# EAGLE schematic borrador_v1 (EAGLE 9.5.2)
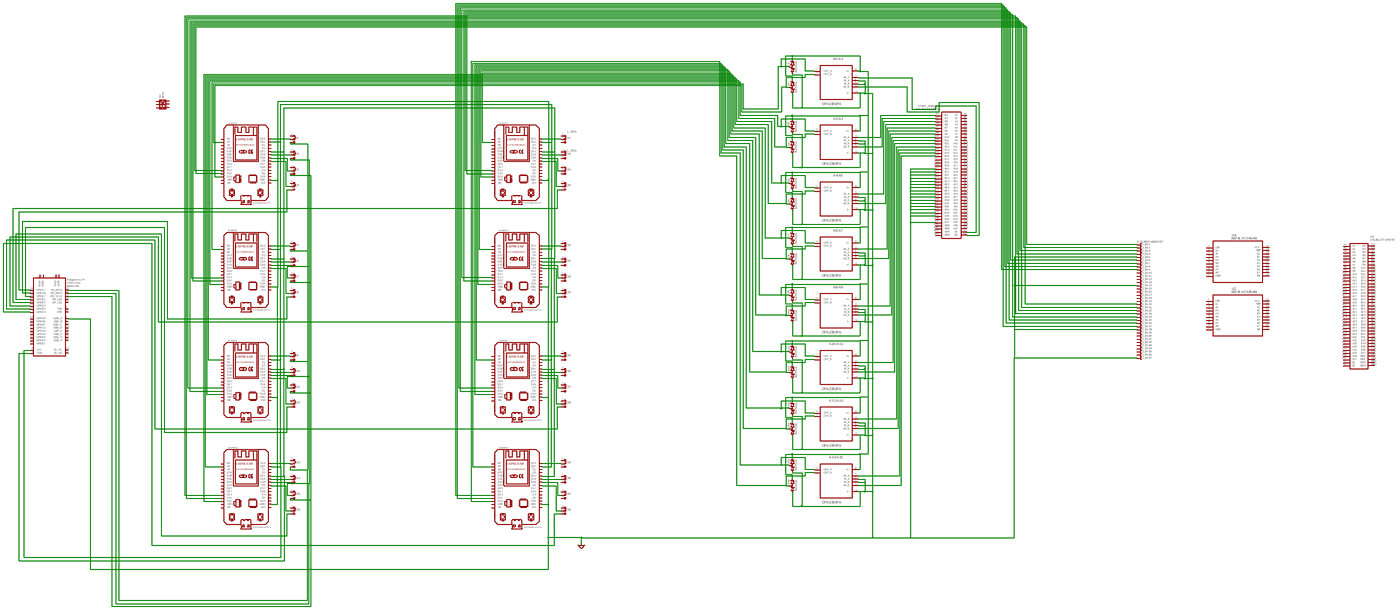
[diagram p0: schematic, sheet 1, overview]
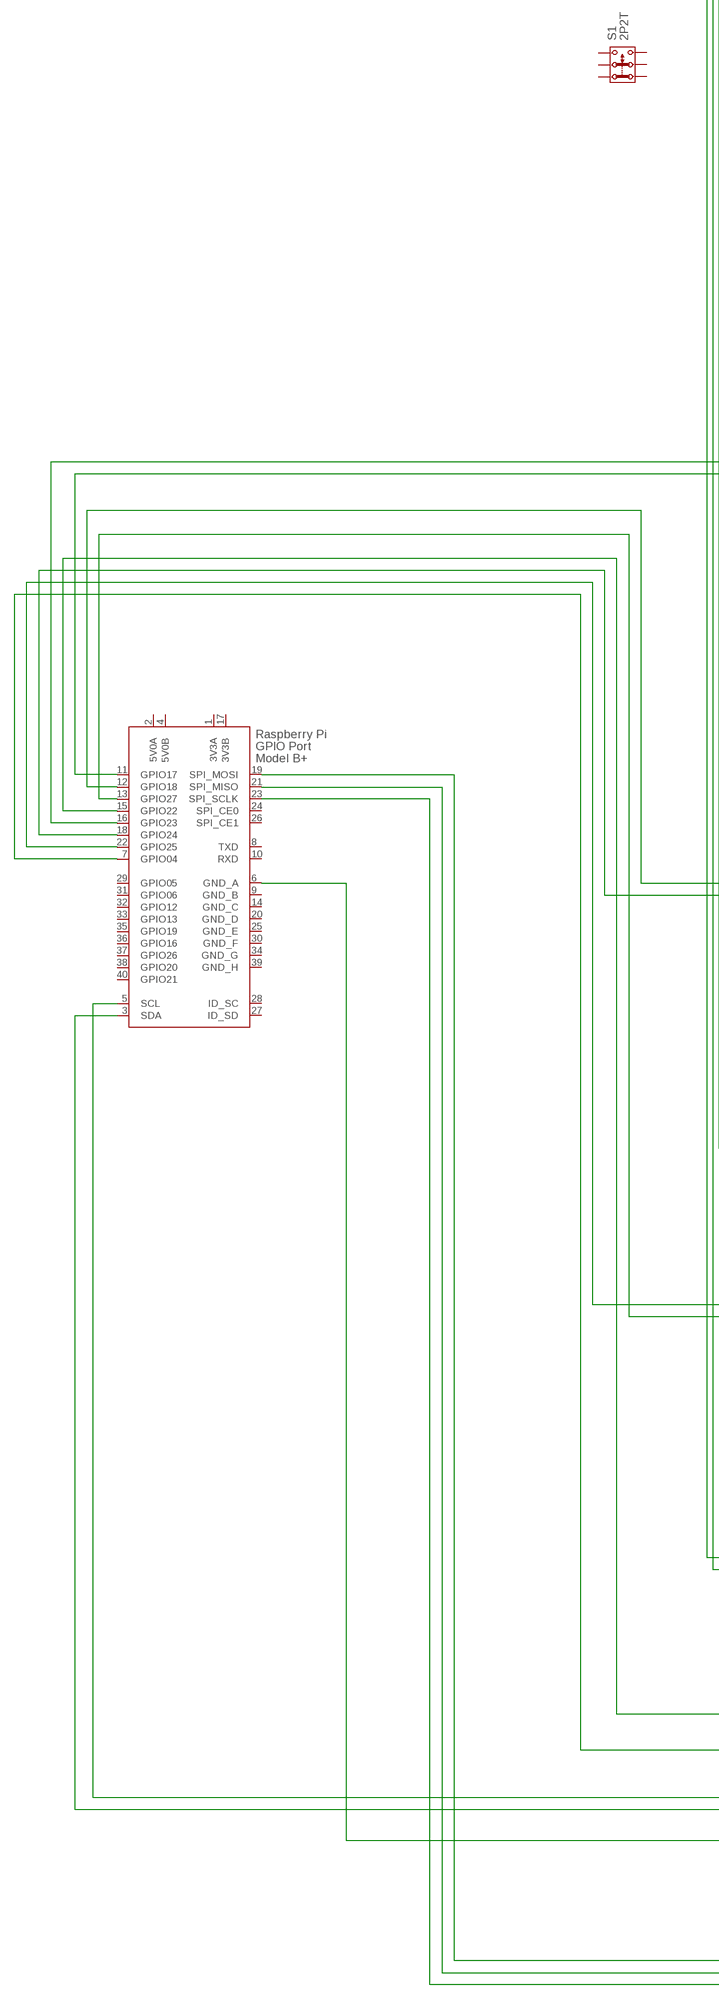
[diagram p1: schematic, sheet 1, part 1 of 4]
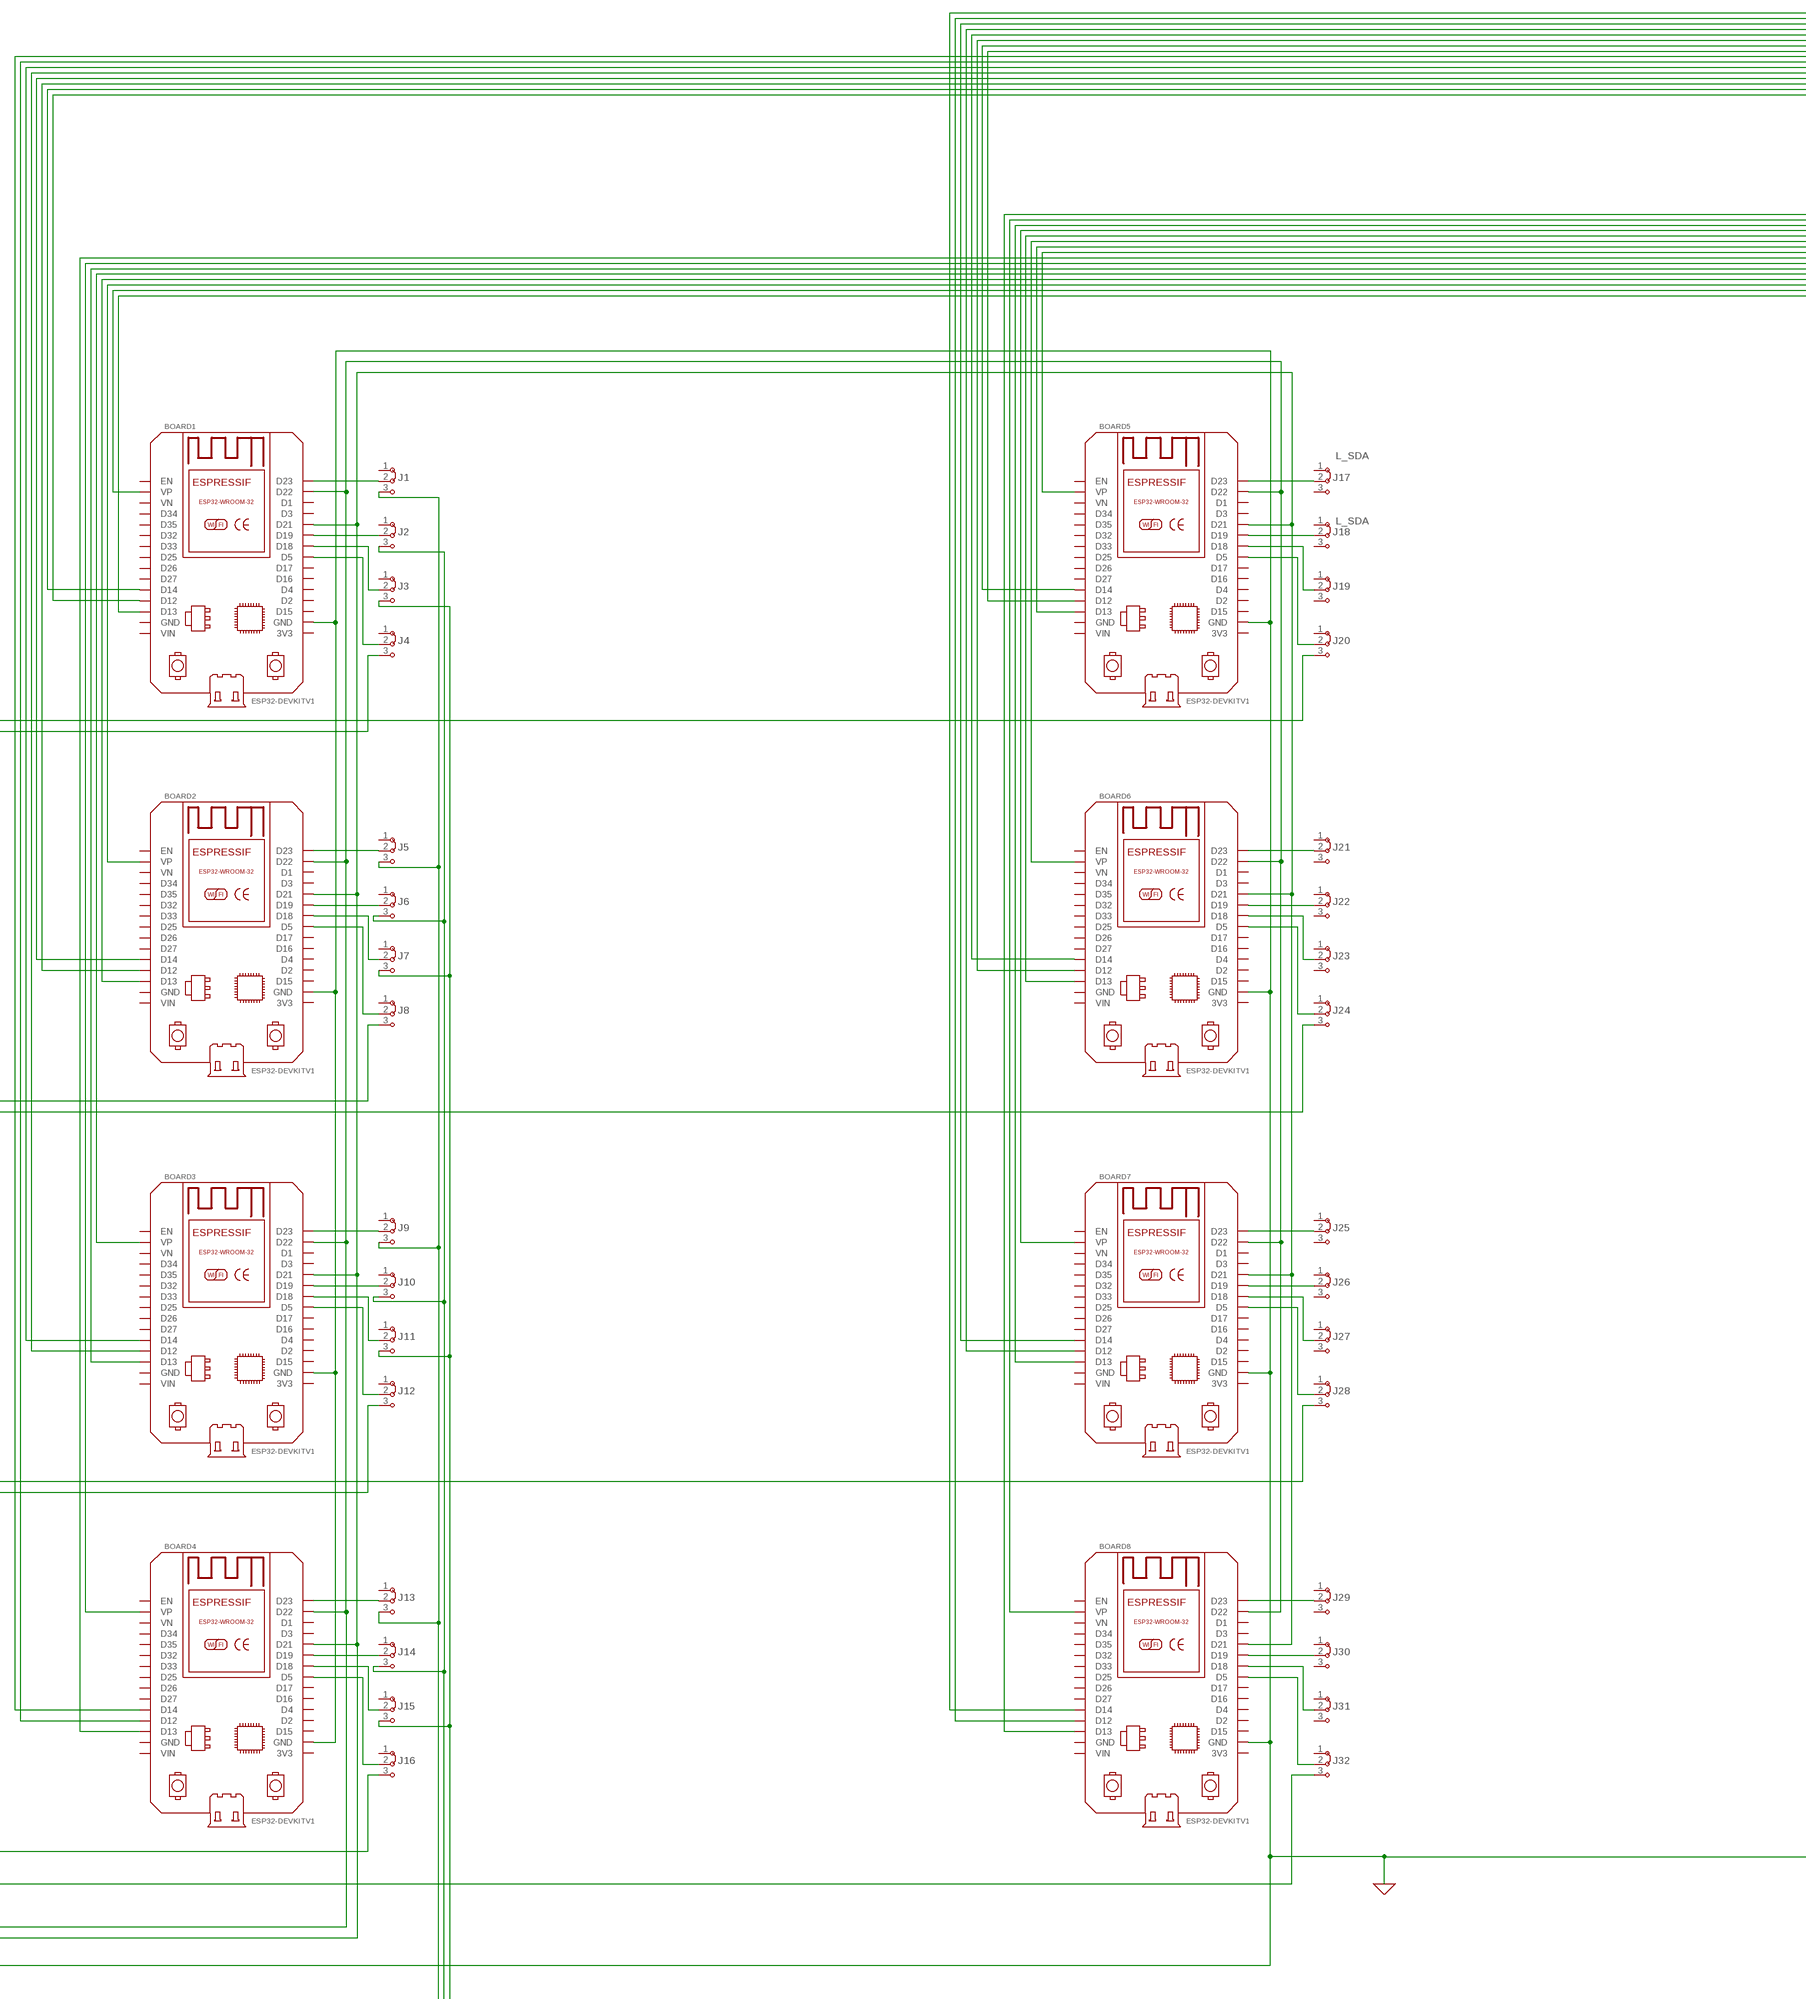
[diagram p2: schematic, sheet 1, part 2 of 4]
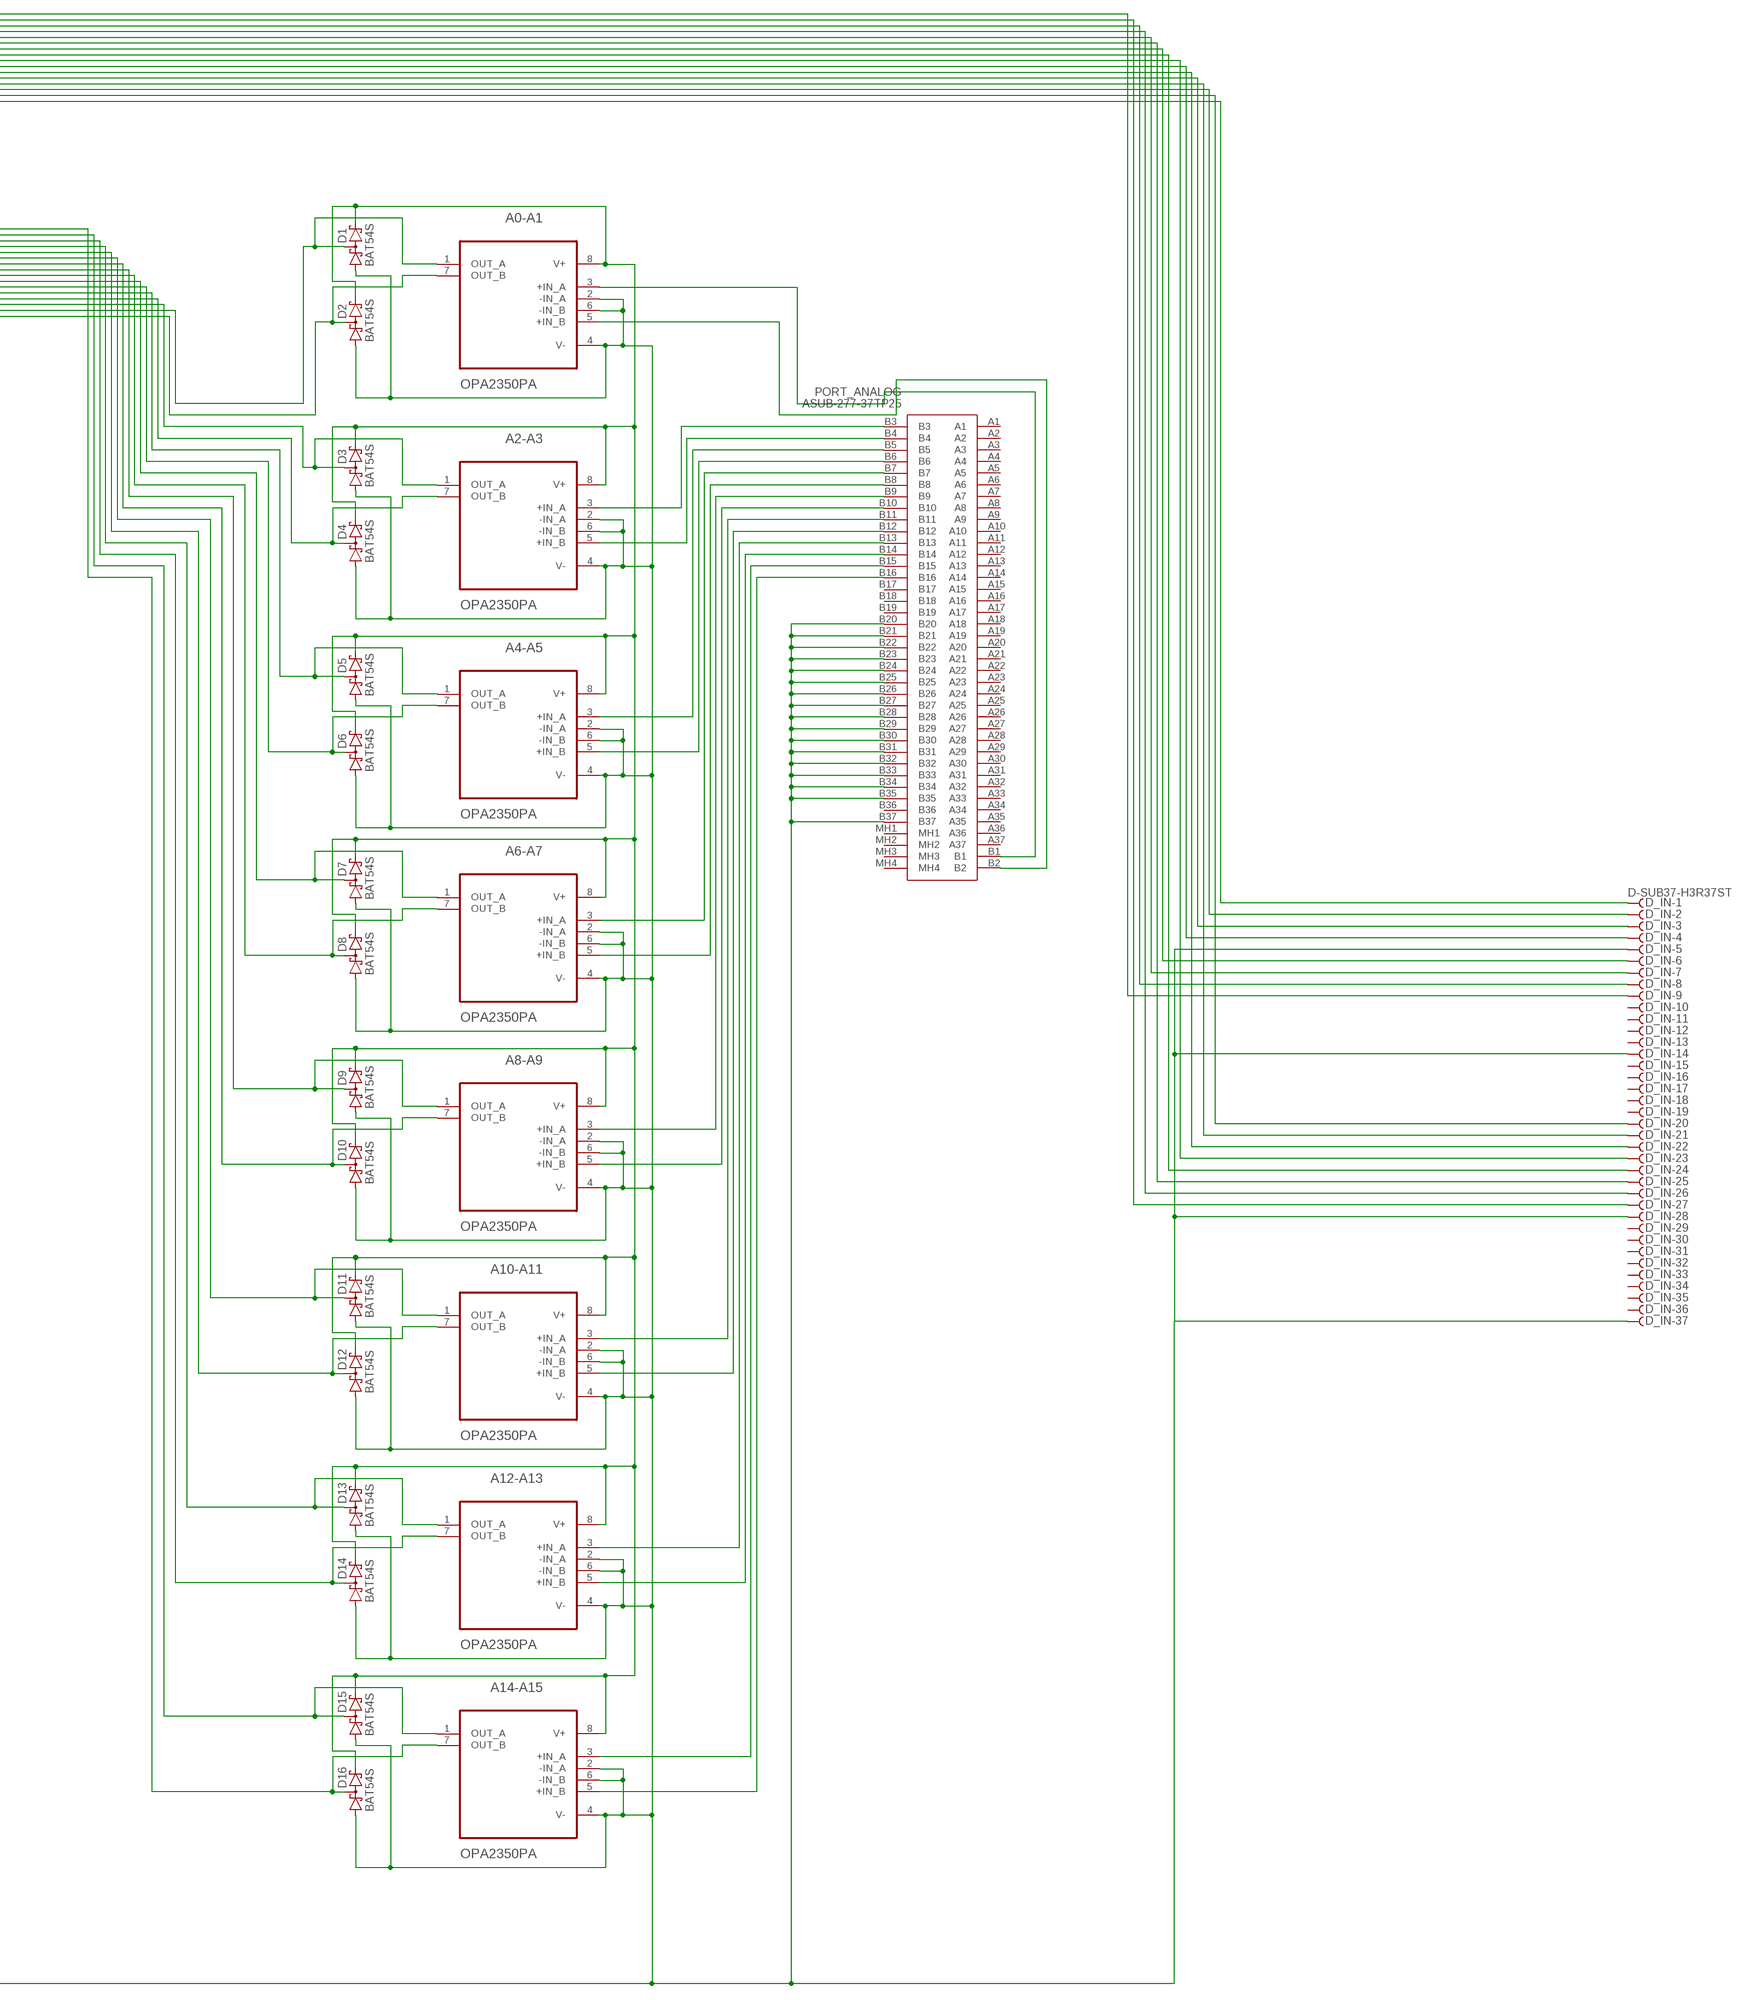
[diagram p3: schematic, sheet 1, part 3 of 4]
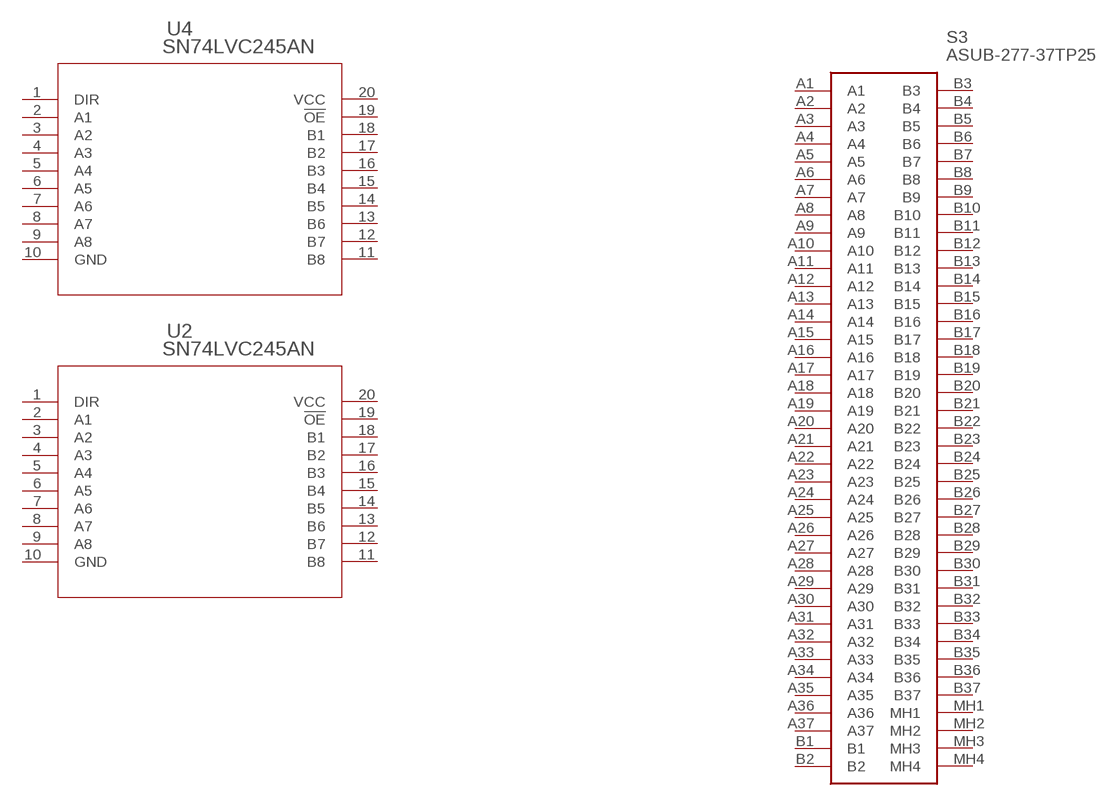
[diagram p4: schematic, sheet 1, part 4 of 4]

## Parts
A0-A1  OPA2350PA  [DIP254P762X508-8]
A2-A3  OPA2350PA  [DIP254P762X508-8]
A4-A5  OPA2350PA  [DIP254P762X508-8]
A6-A7  OPA2350PA  [DIP254P762X508-8]
A8-A9  OPA2350PA  [DIP254P762X508-8]
A10-A11  OPA2350PA  [DIP254P762X508-8]
A12-A13  OPA2350PA  [DIP254P762X508-8]
A14-A15  OPA2350PA  [DIP254P762X508-8]
BOARD1  ESP32DEVKITV1  [ESP32-DEVKITV1]
BOARD2  ESP32DEVKITV1  [ESP32-DEVKITV1]
BOARD3  ESP32DEVKITV1  [ESP32-DEVKITV1]
BOARD4  ESP32DEVKITV1  [ESP32-DEVKITV1]
BOARD5  ESP32DEVKITV1  [ESP32-DEVKITV1]
BOARD6  ESP32DEVKITV1  [ESP32-DEVKITV1]
BOARD7  ESP32DEVKITV1  [ESP32-DEVKITV1]
BOARD8  ESP32DEVKITV1  [ESP32-DEVKITV1]
D1  BAT54S  [SOT23]
D2  BAT54S  [SOT23]
D3  BAT54S  [SOT23]
D4  BAT54S  [SOT23]
D5  BAT54S  [SOT23]
D6  BAT54S  [SOT23]
D7  BAT54S  [SOT23]
D8  BAT54S  [SOT23]
D9  BAT54S  [SOT23]
D10  BAT54S  [SOT23]
D11  BAT54S  [SOT23]
D12  BAT54S  [SOT23]
D13  BAT54S  [SOT23]
D14  BAT54S  [SOT23]
D15  BAT54S  [SOT23]
D16  BAT54S  [SOT23]
D_IN  D-SUB37-H3R37ST  [H2R37ST]
J1  J2X2MM  [04C]
J2  J2X2MM  [04C]
J3  J2X2MM  [04C]
J4  J2X2MM  [04C]
J5  J2X2MM  [04C]
J6  J2X2MM  [04C]
J7  J2X2MM  [04C]
J8  J2X2MM  [04C]
J9  J2X2MM  [04C]
J10  J2X2MM  [04C]
J11  J2X2MM  [04C]
J12  J2X2MM  [04C]
J13  J2X2MM  [04C]
J14  J2X2MM  [04C]
J15  J2X2MM  [04C]
J16  J2X2MM  [04C]
J17  J2X2MM  [04C]
J18  J2X2MM  [04C]
J19  J2X2MM  [04C]
J20  J2X2MM  [04C]
J21  J2X2MM  [04C]
J22  J2X2MM  [04C]
J23  J2X2MM  [04C]
J24  J2X2MM  [04C]
J25  J2X2MM  [04C]
J26  J2X2MM  [04C]
J27  J2X2MM  [04C]
J28  J2X2MM  [04C]
J29  J2X2MM  [04C]
J30  J2X2MM  [04C]
J31  J2X2MM  [04C]
J32  J2X2MM  [04C]
PORT_ANALOG  ASUB-277-37TP25  [ASUB27737TP25]
S1  2P2T  [2P2T]
S3  ASUB-277-37TP25  [ASUB27737TP25]
U2  SN74LVC245AN  [N20]
U4  SN74LVC245AN  [N20]
X1  RASPI_GPIO_B+#_PIN  [RASPI_GPIO_B+_PIN]

## Nets
L_3V3: A0-A1.8(V+) A2-A3.8(V+) A4-A5.8(V+) A6-A7.8(V+) A8-A9.8(V+) A10-A11.8(V+) A12-A13.8(V+) A14-A15.8(V+) D1.2(C2) D2.2(C2) D3.2(C2) D4.2(C2) D5.2(C2) D6.2(C2) D7.2(C2) D8.2(C2) D9.2(C2) D10.2(C2) D11.2(C2) D12.2(C2) D13.2(C2) D14.2(C2) D15.2(C2) D16.2(C2)
L_AO_0: A0-A1.1(OUT_A) BOARD1.VP D1.3(C1A2)
L_AO_0_P: A0-A1.3(+IN_A) PORT_ANALOG.B1
L_AO_1: A0-A1.7(OUT_B) BOARD1.D13 D2.3(C1A2)
L_AO_1_P: A0-A1.5(+IN_B) PORT_ANALOG.B2
L_AO_2: A2-A3.1(OUT_A) BOARD2.VP D3.3(C1A2)
L_AO_2_P: A2-A3.3(+IN_A) PORT_ANALOG.B3
L_AO_3: A2-A3.7(OUT_B) BOARD2.D13 D4.3(C1A2)
L_AO_3_P: A2-A3.5(+IN_B) PORT_ANALOG.B4
L_AO_4: A4-A5.1(OUT_A) BOARD3.VP D5.3(C1A2)
L_AO_4_P: A4-A5.3(+IN_A) PORT_ANALOG.B5
L_AO_5: A4-A5.7(OUT_B) BOARD3.D13 D6.3(C1A2)
L_AO_5_P: A4-A5.5(+IN_B) PORT_ANALOG.B6
L_AO_6: A6-A7.1(OUT_A) BOARD4.VP D7.3(C1A2)
L_AO_6_P: A6-A7.3(+IN_A) PORT_ANALOG.B7
L_AO_7: A6-A7.7(OUT_B) BOARD4.D13 D8.3(C1A2)
L_AO_7_P: A6-A7.5(+IN_B) PORT_ANALOG.B8
L_AO_8: A8-A9.1(OUT_A) BOARD5.VP D9.3(C1A2)
L_AO_8_P: A8-A9.3(+IN_A) PORT_ANALOG.B9
L_AO_9: A8-A9.7(OUT_B) BOARD5.D13 D10.3(C1A2)
L_AO_9_P: A8-A9.5(+IN_B) PORT_ANALOG.B10
L_AO_10: A10-A11.1(OUT_A) BOARD6.VP D11.3(C1A2)
L_AO_10_P: A10-A11.3(+IN_A) PORT_ANALOG.B11
L_AO_11: A10-A11.7(OUT_B) BOARD6.D13 D12.3(C1A2)
L_AO_11_P: A10-A11.5(+IN_B) PORT_ANALOG.B12
L_AO_12: A12-A13.1(OUT_A) BOARD7.VP D13.3(C1A2)
L_AO_12_P: A12-A13.3(+IN_A) PORT_ANALOG.B13
L_AO_13: A12-A13.7(OUT_B) BOARD7.D13 D14.3(C1A2)
L_AO_13_P: A12-A13.5(+IN_B) PORT_ANALOG.B14
L_AO_14: A14-A15.1(OUT_A) BOARD8.VP D15.3(C1A2)
L_AO_14_P: A14-A15.3(+IN_A) PORT_ANALOG.B15
L_AO_15: A14-A15.7(OUT_B) BOARD8.D13 D16.3(C1A2)
L_AO_15_P: A14-A15.5(+IN_B) PORT_ANALOG.B16
L_DI_0: BOARD1.D12 D_IN.1
L_DI_1: BOARD1.D14 D_IN.20
L_DI_2: BOARD2.D12 D_IN.2
L_DI_3: BOARD2.D14 D_IN.21
L_DI_4: BOARD3.D12 D_IN.3
L_DI_5: BOARD3.D14 D_IN.22
L_DI_6: BOARD4.D12 D_IN.4
L_DI_7: BOARD4.D14 D_IN.23
L_DI_8: BOARD5.D12 D_IN.24
L_DI_9: BOARD5.D14 D_IN.6
L_DI_10: BOARD6.D12 D_IN.25
L_DI_11: BOARD6.D14 D_IN.7
L_DI_012: BOARD7.D12 D_IN.26
L_DI_13: BOARD7.D14 D_IN.8
L_DI_014: BOARD8.D12 D_IN.27
L_DI_015: BOARD8.D14 D_IN.9
L_GROUND: A0-A1.2(-IN_A) A0-A1.4(V-) A0-A1.6(-IN_B) A2-A3.2(-IN_A) A2-A3.4(V-) A2-A3.6(-IN_B) A4-A5.2(-IN_A) A4-A5.4(V-) A4-A5.6(-IN_B) A6-A7.2(-IN_A) A6-A7.4(V-) A6-A7.6(-IN_B) A8-A9.2(-IN_A) A8-A9.4(V-) A8-A9.6(-IN_B) A10-A11.2(-IN_A) A10-A11.4(V-) A10-A11.6(-IN_B) A12-A13.2(-IN_A) A12-A13.4(V-) A12-A13.6(-IN_B) A14-A15.2(-IN_A) A14-A15.4(V-) A14-A15.6(-IN_B) BOARD1.GND@1(GND) BOARD2.GND@1(GND) BOARD3.GND@1(GND) BOARD4.GND@1(GND) BOARD5.GND@1(GND) BOARD6.GND@1(GND) BOARD7.GND@1(GND) BOARD8.GND@1(GND) D1.1(A1) D2.1(A1) D3.1(A1) D4.1(A1) D5.1(A1) D6.1(A1) D7.1(A1) D8.1(A1) D9.1(A1) D10.1(A1) D11.1(A1) D12.1(A1) D13.1(A1) D14.1(A1) D15.1(A1) D16.1(A1) D_IN.5 D_IN.14 D_IN.28 D_IN.37 PORT_ANALOG.B20 PORT_ANALOG.B21 PORT_ANALOG.B22 PORT_ANALOG.B23 PORT_ANALOG.B24 PORT_ANALOG.B25 PORT_ANALOG.B26 PORT_ANALOG.B27 PORT_ANALOG.B28 PORT_ANALOG.B29 PORT_ANALOG.B30 PORT_ANALOG.B31 PORT_ANALOG.B32 PORT_ANALOG.B33 PORT_ANALOG.B34 PORT_ANALOG.B35 PORT_ANALOG.B37 X1.6(GND_A) ; supply symbol labelled GND
L_MISO_MOD1: BOARD1.D19 J2.2
L_MISO_SPI: J2.3 J6.3 J10.3 J14.3 X1.21(SPI_MISO)
L_MOSI_MOD1: BOARD1.D23 J1.2
L_MOSI_SPI: J1.3 J5.3 J9.3 J13.3 X1.19(SPI_MOSI)
L_SCK_MOD1: BOARD1.D18 J3.2
L_SCK_SPI: J3.3 J7.3 J11.3 J15.3 X1.23(SPI_SCLK)
L_SCL: BOARD1.D22 BOARD2.D22 BOARD3.D22 BOARD4.D22 BOARD5.D22 BOARD6.D22 BOARD7.D22 BOARD8.D22 X1.5(SCL)
L_SDA: BOARD1.D21 BOARD2.D21 BOARD3.D21 BOARD4.D21 BOARD5.D21 BOARD6.D21 BOARD7.D21 BOARD8.D21 X1.3(SDA)
N$1: J4.3 X1.11(GPIO17)
N$2: J8.3 X1.12(GPIO18)
N$3: J12.3 X1.13(GPIO27)
N$4: BOARD1.D5 J4.2
N$5: BOARD2.D23 J5.2
N$6: BOARD2.D19 J6.2
N$7: BOARD2.D18 J7.2
N$8: BOARD2.D5 J8.2
N$9: BOARD3.D23 J9.2
N$10: BOARD3.D19 J10.2
N$11: BOARD3.D18 J11.2
N$12: BOARD3.D5 J12.2
N$13: BOARD4.D23 J13.2
N$14: BOARD4.D19 J14.2
N$15: BOARD4.D18 J15.2
N$16: BOARD4.D5 J16.2
N$17: BOARD5.D23 J17.2
N$18: BOARD5.D19 J18.2
N$19: BOARD5.D18 J19.2
N$20: BOARD5.D5 J20.2
N$21: BOARD6.D23 J21.2
N$22: BOARD6.D19 J22.2
N$23: BOARD6.D18 J23.2
N$24: BOARD6.D5 J24.2
N$25: BOARD7.D23 J25.2
N$26: BOARD7.D19 J26.2
N$27: BOARD7.D18 J27.2
N$28: BOARD7.D5 J28.2
N$29: BOARD8.D23 J29.2
N$30: BOARD8.D19 J30.2
N$31: BOARD8.D18 J31.2
N$32: BOARD8.D5 J32.2
N$33: J16.3 X1.15(GPIO22)
N$34: J20.3 X1.16(GPIO23)
N$36: J24.3 X1.18(GPIO24)
N$37: J28.3 X1.22(GPIO25)
N$38: J32.3 X1.7(GPIO04)
Unconnected: BOARD1.3V3 BOARD1.D1 BOARD1.D2 BOARD1.D3 BOARD1.D4 BOARD1.D15 BOARD1.D16 BOARD1.D17 BOARD1.D25 BOARD1.D26 BOARD1.D27 BOARD1.D32 BOARD1.D33 BOARD1.D34 BOARD1.D35 BOARD1.EN BOARD1.GND BOARD1.VIN BOARD1.VN BOARD2.3V3 BOARD2.D1 BOARD2.D2 BOARD2.D3 BOARD2.D4 BOARD2.D15 BOARD2.D16 BOARD2.D17 BOARD2.D25 BOARD2.D26 BOARD2.D27 BOARD2.D32 BOARD2.D33 BOARD2.D34 BOARD2.D35 BOARD2.EN BOARD2.GND BOARD2.VIN BOARD2.VN BOARD3.3V3 BOARD3.D1 BOARD3.D2 BOARD3.D3 BOARD3.D4 BOARD3.D15 BOARD3.D16 BOARD3.D17 BOARD3.D25 BOARD3.D26 BOARD3.D27 BOARD3.D32 BOARD3.D33 BOARD3.D34 BOARD3.D35 BOARD3.EN BOARD3.GND BOARD3.VIN BOARD3.VN BOARD4.3V3 BOARD4.D1 BOARD4.D2 BOARD4.D3 BOARD4.D4 BOARD4.D15 BOARD4.D16 BOARD4.D17 BOARD4.D25 BOARD4.D26 BOARD4.D27 BOARD4.D32 BOARD4.D33 BOARD4.D34 BOARD4.D35 BOARD4.EN BOARD4.GND BOARD4.VIN BOARD4.VN BOARD5.3V3 BOARD5.D1 BOARD5.D2 BOARD5.D3 BOARD5.D4 BOARD5.D15 BOARD5.D16 BOARD5.D17 BOARD5.D25 BOARD5.D26 BOARD5.D27 BOARD5.D32 BOARD5.D33 BOARD5.D34 BOARD5.D35 BOARD5.EN BOARD5.GND BOARD5.VIN BOARD5.VN BOARD6.3V3 BOARD6.D1 BOARD6.D2 BOARD6.D3 BOARD6.D4 BOARD6.D15 BOARD6.D16 BOARD6.D17 BOARD6.D25 BOARD6.D26 BOARD6.D27 BOARD6.D32 BOARD6.D33 BOARD6.D34 BOARD6.D35 BOARD6.EN BOARD6.GND BOARD6.VIN BOARD6.VN BOARD7.3V3 BOARD7.D1 BOARD7.D2 BOARD7.D3 BOARD7.D4 BOARD7.D15 BOARD7.D16 BOARD7.D17 BOARD7.D25 BOARD7.D26 BOARD7.D27 BOARD7.D32 BOARD7.D33 BOARD7.D34 BOARD7.D35 BOARD7.EN BOARD7.GND BOARD7.VIN BOARD7.VN BOARD8.3V3 BOARD8.D1 BOARD8.D2 BOARD8.D3 BOARD8.D4 BOARD8.D15 BOARD8.D16 BOARD8.D17 BOARD8.D25 BOARD8.D26 BOARD8.D27 BOARD8.D32 BOARD8.D33 BOARD8.D34 BOARD8.D35 BOARD8.EN BOARD8.GND BOARD8.VIN BOARD8.VN D_IN.10 D_IN.11 D_IN.12 D_IN.13 D_IN.15 D_IN.16 D_IN.17 D_IN.18 D_IN.19 D_IN.29 D_IN.30 D_IN.31 D_IN.32 D_IN.33 D_IN.34 D_IN.35 D_IN.36 J1.1 J2.1 J3.1 J4.1 J5.1 J6.1 J7.1 J8.1 J9.1 J10.1 J11.1 J12.1 J13.1 J14.1 J15.1 J16.1 J17.1 J17.3 J18.1 J18.3 J19.1 J19.3 J20.1 J21.1 J21.3 J22.1 J22.3 J23.1 J23.3 J24.1 J25.1 J25.3 J26.1 J26.3 J27.1 J27.3 J28.1 J29.1 J29.3 J30.1 J30.3 J31.1 J31.3 J32.1 PORT_ANALOG.A1 PORT_ANALOG.A2 PORT_ANALOG.A3 PORT_ANALOG.A4 PORT_ANALOG.A5 PORT_ANALOG.A6 PORT_ANALOG.A7 PORT_ANALOG.A8 PORT_ANALOG.A9 PORT_ANALOG.A10 PORT_ANALOG.A11 PORT_ANALOG.A12 PORT_ANALOG.A13 PORT_ANALOG.A14 PORT_ANALOG.A15 PORT_ANALOG.A16 PORT_ANALOG.A17 PORT_ANALOG.A18 PORT_ANALOG.A19 PORT_ANALOG.A20 PORT_ANALOG.A21 PORT_ANALOG.A22 PORT_ANALOG.A23 PORT_ANALOG.A24 PORT_ANALOG.A25 PORT_ANALOG.A26 PORT_ANALOG.A27 PORT_ANALOG.A28 PORT_ANALOG.A29 PORT_ANALOG.A30 PORT_ANALOG.A31 PORT_ANALOG.A32 PORT_ANALOG.A33 PORT_ANALOG.A34 PORT_ANALOG.A35 PORT_ANALOG.A36 PORT_ANALOG.A37 PORT_ANALOG.B17 PORT_ANALOG.B18 PORT_ANALOG.B19 PORT_ANALOG.B36 PORT_ANALOG.MH1 PORT_ANALOG.MH2 PORT_ANALOG.MH3 PORT_ANALOG.MH4 S1.1.1 S1.1.2 S1.2.1 S1.2.2 S1.3.1 S1.3.2 S3.A1 S3.A2 S3.A3 S3.A4 S3.A5 S3.A6 S3.A7 S3.A8 S3.A9 S3.A10 S3.A11 S3.A12 S3.A13 S3.A14 S3.A15 S3.A16 S3.A17 S3.A18 S3.A19 S3.A20 S3.A21 S3.A22 S3.A23 S3.A24 S3.A25 S3.A26 S3.A27 S3.A28 S3.A29 S3.A30 S3.A31 S3.A32 S3.A33 S3.A34 S3.A35 S3.A36 S3.A37 S3.B1 S3.B2 S3.B3 S3.B4 S3.B5 S3.B6 S3.B7 S3.B8 S3.B9 S3.B10 S3.B11 S3.B12 S3.B13 S3.B14 S3.B15 S3.B16 S3.B17 S3.B18 S3.B19 S3.B20 S3.B21 S3.B22 S3.B23 S3.B24 S3.B25 S3.B26 S3.B27 S3.B28 S3.B29 S3.B30 S3.B31 S3.B32 S3.B33 S3.B34 S3.B35 S3.B36 S3.B37 S3.MH1 S3.MH2 S3.MH3 S3.MH4 U2.1(DIR) U2.2(A1) U2.3(A2) U2.4(A3) U2.5(A4) U2.6(A5) U2.7(A6) U2.8(A7) U2.9(A8) U2.11(B8) U2.12(B7) U2.13(B6) U2.14(B5) U2.15(B4) U2.16(B3) U2.17(B2) U2.18(B1) U2.19(!OE) U4.1(DIR) U4.2(A1) U4.3(A2) U4.4(A3) U4.5(A4) U4.6(A5) U4.7(A6) U4.8(A7) U4.9(A8) U4.11(B8) U4.12(B7) U4.13(B6) U4.14(B5) U4.15(B4) U4.16(B3) U4.17(B2) U4.18(B1) U4.19(!OE) X1.8(TXD) X1.10(RXD) X1.24(SPI_CE0) X1.26(SPI_CE1) X1.27(ID_SD) X1.28(ID_SC) X1.29(GPIO05) X1.31(GPIO06) X1.32(GPIO12) X1.33(GPIO13) X1.35(GPIO19) X1.36(GPIO16) X1.37(GPIO26) X1.38(GPIO20) X1.40(GPIO21)

## Power pins joined to a net without a drawn wire
3V3A: X1.1(3V3A)
3V3B: X1.17(3V3B)
5V0A: X1.2(5V0A)
5V0B: X1.4(5V0B)
GND: U2.10(GND) U4.10(GND)
GND_B: X1.9(GND_B)
GND_C: X1.14(GND_C)
GND_D: X1.20(GND_D)
GND_E: X1.25(GND_E)
GND_F: X1.30(GND_F)
GND_G: X1.34(GND_G)
GND_H: X1.39(GND_H)
VCC: U2.20(VCC) U4.20(VCC)

## Library data of the parts
A0-A1 A2-A3 A4-A5 A6-A7 A8-A9 A10-A11 A12-A13 A14-A15 = Texas Instruments_By_element14_Batch_1:OPA2350PA: OPERATIONAL AMPLIFIER; MPN: OPA2350PA; OC_FARNELL: 4353316; OC_NEWARK: 75C4730; PACKAGE: PDIP; SUPPLIER: Texas Instruments
BOARD1-BOARD8 = ESP32-DEVKITV1:ESP32DEVKITV1: https://github.com/shridattdudhat
D1-D16 = diode:BAT54S: Schottky Diodes Pin connection corrected 2011-05-04 Source: Fairchild .. BAT54.pdf
D_IN = con-thomas-betts:D-SUB37-: D-Subminiatur Connector Source: Electronioc Interconnects European Edition 1998; OC_FARNELL: unknown; OC_NEWARK: unknown
J1-J32 = jumper:J2: Jumper switch 2 x 2.5 mm
PORT_ANALOG S3 = ASUB-277-37TP25:ASUB-277-37TP25: CONN D-SUB PLUG/RCPT 37P R/A SLD Source: Datasheet <https://datasheet.datasheetarchive.com/originals/dk/DKDS-12/220594.pdf>; DESCRIPTION: CONN D-SUB PLUG/RCPT 37P R/A SLD; HEIGHT: 31.55mm; MANUFACTURER_NAME: ASSMANN WSW components GmbH; MANUFACTURER_PART_NUMBER: ASUB-277-37TP25
S1 = switch:2P2T: SLIDE SWITCH 2P2T Part No. SS-22F05-G(A)4 Source: CANAL ELECTRONIC CO., LTD .. switsch.pdf
U2 U4 = lc245a:SN74LVC245AN; DATASHEET_URL: http://www.ti.com/lit/gpn/SN74LVC245A; DESCRIPTION: Octal Bus Transceiver With 3-State Outputs; FAMILY_NAME: STANDARD TRANSCEIVER; GENERIC_PART_NUMBER: SN74LVC245A; INDUSTRY_STD_PKG_TYPE: PDIP; MANUFACTURER: Texas Instruments; MANUFACTURER_PART_NUMBER: SN74LVC245AN; PACKAGE_DESIGNATOR: N; PIN_COUNT: 20; VENDOR: Texas Instruments
X1 = raspberrypi_bastelstube_v13:RASPI_GPIO_B+#: 2x20 header connector, all pins connected